# EAGLE design Arching_Civet (EAGLE 9.6.2)
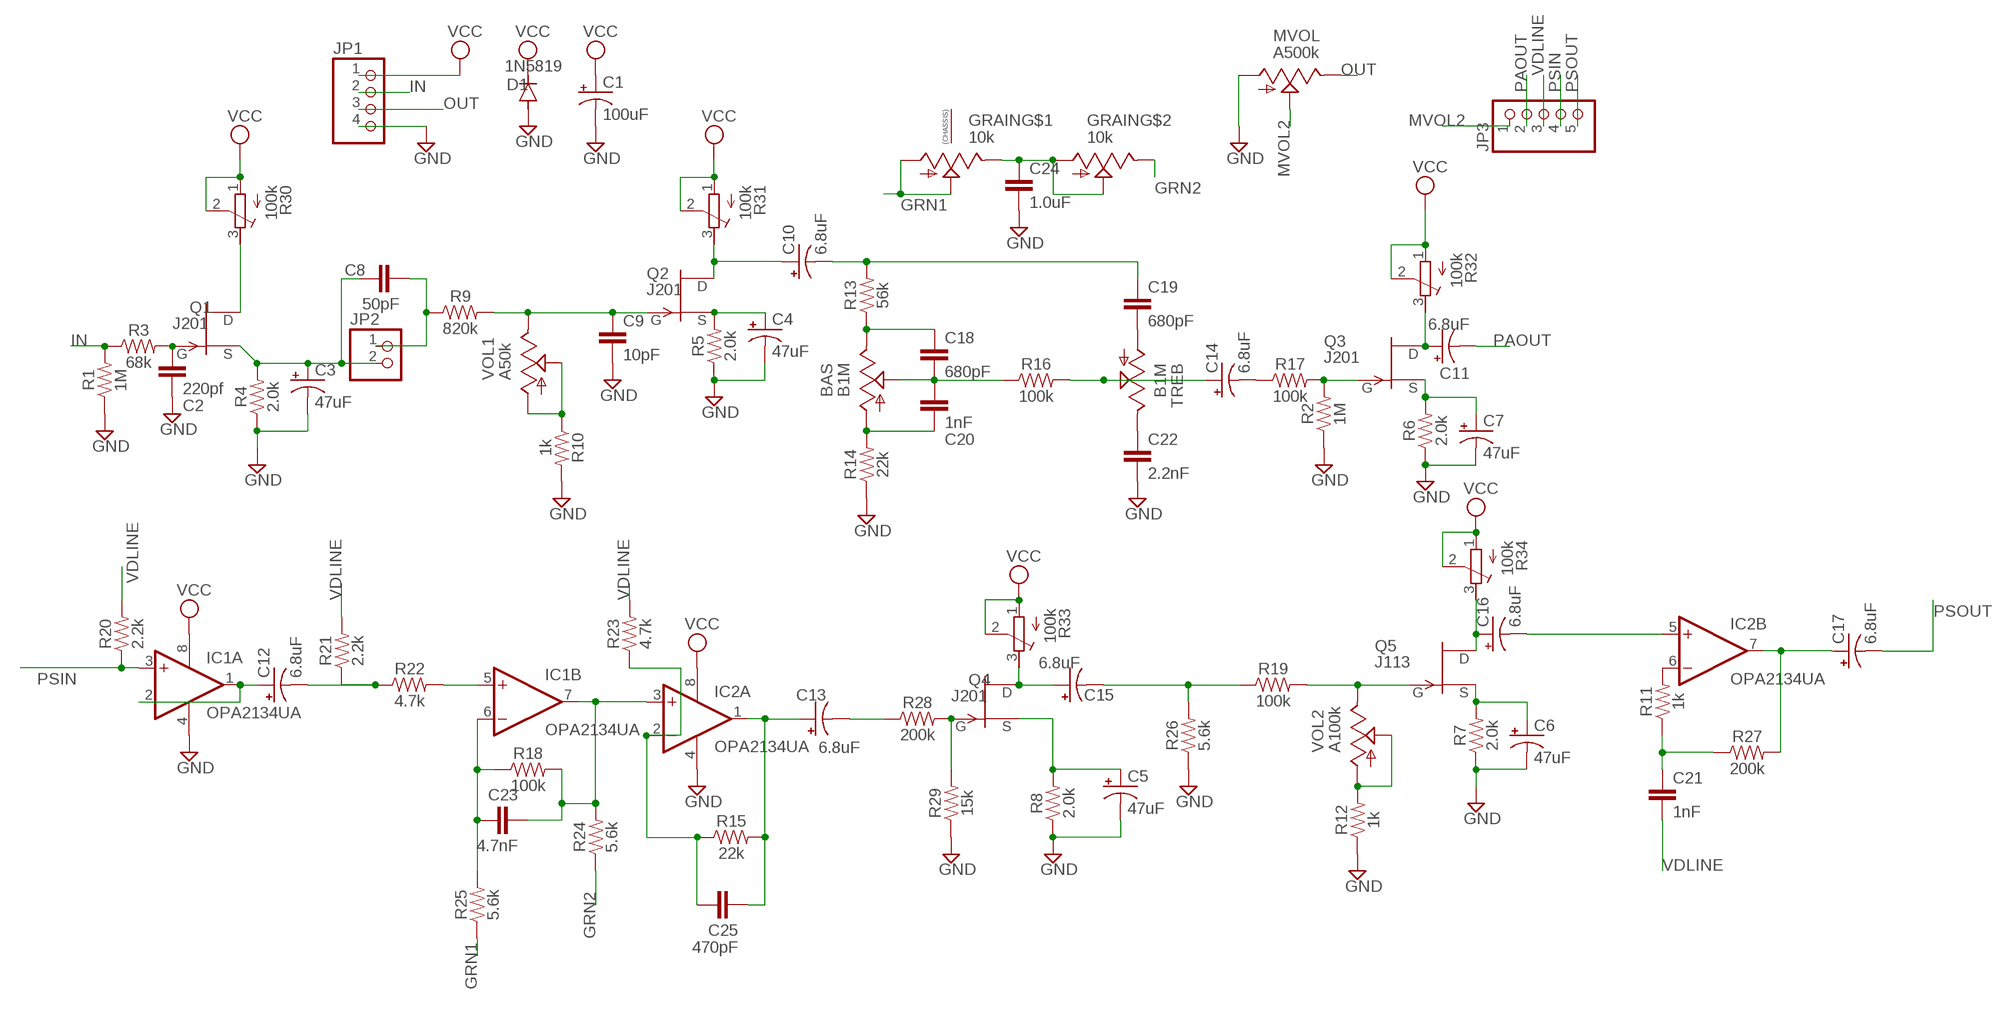
[diagram p0: schematic, sheet 1]

## Parts
BAS  B1M  9MM_SNAP-IN_POT_  [9MM_SNAP-IN_POT]
C1  100uF  CAP_SMD+THRUPAN_B  [PAN_B_SMD+THRU]
C2  220pf  270PF-0603-50V-5%  [0603]
C3  47uF  CAP_SMD+THRUPAN_B  [PAN_B_SMD+THRU]
C4  47uF  CAP_SMD+THRUPAN_B  [PAN_B_SMD+THRU]
C5  47uF  CAP_SMD+THRUPAN_B  [PAN_B_SMD+THRU]
C6  47uF  CAP_SMD+THRUPAN_B  [PAN_B_SMD+THRU]
C7  47uF  CAP_SMD+THRUPAN_B  [PAN_B_SMD+THRU]
C8  50pF  33PF-0603-50V-5%  [0603]
C9  10pF  10PF-0603-50V-5%  [0603]
C10  6.8uF  CAP_SMD+THRUPAN_B  [PAN_B_SMD+THRU]
C11  6.8uF  CAP_SMD+THRUPAN_B  [PAN_B_SMD+THRU]
C12  6.8uF  CAP_SMD+THRUPAN_B  [PAN_B_SMD+THRU]
C13  6.8uF  CAP_SMD+THRUPAN_B  [PAN_B_SMD+THRU]
C14  6.8uF  CAP_SMD+THRUPAN_B  [PAN_B_SMD+THRU]
C15  6.8uF  CAP_SMD+THRUPAN_B  [PAN_B_SMD+THRU]
C16  6.8uF  CAP_SMD+THRUPAN_B  [PAN_B_SMD+THRU]
C17  6.8uF  CAP_SMD+THRUPAN_B  [PAN_B_SMD+THRU]
C18  680pF  680PF-0603-50V-10%  [0603]
C19  680pF  680PF-0603-50V-10%  [0603]
C20  1nF  1.0NF/1000PF-0603-50V-10%  [0603]
C21  1nF  1.0NF/1000PF-0603-50V-10%  [0603]
C22  2.2nF  2.2NF/2200PF-0603-50V-10%  [0603]
C23  4.7nF  3.3NF-0603-100V-10%  [0603]
C24  1.0uF  1.0UF-0603-16V-10%  [0603]
C25  470pF  470PF-0603-50V-5%  [0603]
D1  1N5819  DIODE-SOD123  [SOD123]
GRAIN  10k  ALPHA-9MM-DUALPOT  [DUAL_9MM_SNAP-IN_POT]
IC1  OPA2134UA  [SO08]
IC2  OPA2134UA  [SO08]
JP1  PINHD-1X4  [1X04]
JP2  PINHD-1X2  [1X02]
JP3  PINHD-1X5  [1X05]
MVOL  A500k  9MM_SNAP-IN_POT_  [9MM_SNAP-IN_POT]
Q1  J201  SST201  [SOT23]
Q2  J201  SST201  [SOT23]
Q3  J201  SST201  [SOT23]
Q4  J201  SST201  [SOT23]
Q5  J113  SST201  [SOT23]
R1  1M  1MOHM-0603-1/4W-5%  [0603]
R2  1M  1MOHM-0603-1/4W-5%  [0603]
R3  68k  68.1KOHM-0603-1/10W-1%  [0603]
R4  2.0k  2.0KOHM-0603-1/10W-5%  [0603]
R5  2.0k  2.0KOHM-0603-1/10W-5%  [0603]
R6  2.0k  2.0KOHM-0603-1/10W-5%  [0603]
R7  2.0k  2.0KOHM-0603-1/10W-5%  [0603]
R8  2.0k  2.0KOHM-0603-1/10W-5%  [0603]
R9  820k  820KOHM-0603-1/10W-1%  [0603]
R10  1k  1KOHM-0603-1/10W-1%  [0603]
R11  1k  1KOHM-0603-1/10W-1%  [0603]
R12  1k  1KOHM-0603-1/10W-1%  [0603]
R13  56k  RESISTOR0603  [0603]
R14  22k  22KOHM-0603-1/10W-1%  [0603]
R15  22k  22KOHM-0603-1/10W-1%  [0603]
R16  100k  100KOHM-0603-1/10W-1%  [0603]
R17  100k  100KOHM-0603-1/10W-1%  [0603]
R18  100k  100KOHM-0603-1/10W-1%  [0603]
R19  100k  100KOHM-0603-1/10W-1%  [0603]
R20  2.2k  2.2KOHM-0603-1/10W-1%  [0603]
R21  2.2k  2.2KOHM-0603-1/10W-1%  [0603]
R22  4.7k  4.7KOHM-0603-1/10W-1%  [0603]
R23  4.7k  4.7KOHM-0603-1/10W-1%  [0603]
R24  5.6k  5.6KOHM-0603-1/10W-1%  [0603]
R25  5.6k  5.6KOHM-0603-1/10W-1%  [0603]
R26  5.6k  5.6KOHM-0603-1/10W-1%  [0603]
R27  200k  200KOHM-0603-1/10W-1%  [0603]
R28  200k  200KOHM-0603-1/10W-1%  [0603]
R29  15k  15KOHM-0603-1/10W-1%  [0603]
R30  100k  R-TRIMM3296W  [RTRIM3296W]
R31  100k  R-TRIMM3296W  [RTRIM3296W]
R32  100k  R-TRIMM3296W  [RTRIM3296W]
R33  100k  R-TRIMM3296W  [RTRIM3296W]
R34  100k  R-TRIMM3296W  [RTRIM3296W]
TREB  B1M  9MM_SNAP-IN_POT_  [9MM_SNAP-IN_POT]
VOL1  A50k  9MM_SNAP-IN_POT_  [9MM_SNAP-IN_POT]
VOL2  A100k  9MM_SNAP-IN_POT_  [9MM_SNAP-IN_POT]

## Nets
GND: C1.- C1.--(-) C2.2 C3.- C3.--(-) C4.- C4.--(-) C5.- C5.--(-) C6.- C6.--(-) C7.- C7.--(-) C9.2 C22.2 C24.2 D1.A IC1.4(A:V-) IC2.4(A:V-) JP1.4 MVOL.1(A) R1.1 R2.1 R4.1 R5.1 R6.1 R7.1 R8.1 R10.2 R12.1 R14.1 R26.1 R29.1
GRN1: GRAIN.1(A) GRAIN.2(S) R25.1
GRN2: GRAIN.3B(E) R24.1
IN: JP1.2 R1.2 R3.1
MVOL2: JP3.1 MVOL.2(S)
N$1: C2.1 Q1.3(G) R3.2
N$2: Q1.1(D) R30.3(E)
N$3: C3.+ C3.++(+) C8.1 JP2.2 Q1.2(S) R4.2
N$4: C8.2 JP2.1 R9.1
N$5: R10.1 VOL1.1(A) VOL1.2(S)
N$6: C9.1 Q2.3(G) R9.2 VOL1.3(E)
N$7: C10.+ C10.++(+) Q2.1(D) R31.3(E)
N$8: C4.+ C4.++(+) Q2.2(S) R5.2
N$9: C10.- C10.--(-) C19.1 R13.2
N$10: BAS.3(E) C18.1 R13.1
N$11: BAS.1(A) C20.2 R14.2
N$12: BAS.2(S) C18.2 C20.1 R16.1
N$13: C22.1 TREB.3(E)
N$14: C19.2 TREB.1(A)
N$15: C14.+ C14.++(+) R16.2 TREB.2(S)
N$16: C14.- C14.--(-) R17.1
N$17: Q3.3(G) R2.2 R17.2
N$18: C7.+ C7.++(+) Q3.2(S) R6.2
N$19: C11.+ C11.++(+) Q3.1(D) R32.3(E)
N$21: C12.+ C12.++(+) IC1.1(A:OUT) IC1.2(A:-IN)
N$22: C12.- C12.--(-) R21.1 R22.1
N$23: IC1.5(B:+IN) R22.2
N$24: C23.1 IC1.6(B:-IN) R18.1 R25.2
N$25: C23.2 IC1.7(B:OUT) IC2.3(A:+IN) R18.2 R24.2
N$26: C24.1 GRAIN.1B(A) GRAIN.2B(S) GRAIN.3(E)
N$27: C25.1 IC2.2(A:-IN) R15.1 R23.1
N$28: C13.+ C13.++(+) C25.2 IC2.1(A:OUT) R15.2
N$29: C13.- C13.--(-) R28.1
N$30: Q4.3(G) R28.2 R29.2
N$31: C5.+ C5.++(+) Q4.2(S) R8.2
N$32: C15.+ C15.++(+) Q4.1(D) R33.3(E)
N$33: Q5.3(G) R19.2 VOL2.3(E)
N$34: C15.- C15.--(-) R19.1 R26.2
N$35: C6.+ C6.++(+) Q5.2(S) R7.2
N$36: C16.- C16.--(-) IC2.5(B:+IN)
N$37: C16.+ C16.++(+) Q5.1(D) R34.3(E)
N$38: IC2.6(B:-IN) R11.2
N$39: C21.1 R11.1 R27.1
N$40: C17.+ C17.++(+) IC2.7(B:OUT) R27.2
N$41: R12.2 VOL2.1(A) VOL2.2(S)
OUT: JP1.3 MVOL.3(E)
PAOUT: C11.- C11.--(-) JP3.2
PSIN: IC1.3(A:+IN) JP3.4 R20.1
PSOUT: C17.- C17.--(-) JP3.5
VCC: C1.+ C1.++(+) D1.C IC1.8(A:V+) IC2.8(A:V+) JP1.1 R30.1(A) R30.2(S) R31.1(A) R31.2(S) R32.1(A) R32.2(S) R33.1(A) R33.2(S) R34.1(A) R34.2(S)
VDLINE: C21.2 JP3.3 R20.2 R21.2 R23.2
Unconnected: GRAIN.CHASSIS1 GRAIN.CHASSIS2

## Library data of the parts
BAS MVOL TREB VOL1 VOL2 = MusicThingModular:9MM_SNAP-IN_POT: 9mm vertical snap-in pot, Alpha / Panasonic style
C1 C3-C7 C10-C17 = MusicThingModular:CAP_SMD+THRU
C2 = SparkFun-Capacitors:270PF: 270pF/0.27nF ceramic capacitors A capacitor is a passive two-terminal electrical component used to store electrical energy temporarily in an electric field.; PROD_ID: CAP-13339; VALUE: 270PF
C8 = SparkFun-Capacitors:33PF: 33pF ceramic capacitors A capacitor is a passive two-terminal electrical component used to store electrical energy temporarily in an electric field.; PROD_ID: CAP-10142; VALUE: 33pF
C9 = SparkFun-Capacitors:10PF: 10pF ceramic capacitors A capacitor is a passive two-terminal electrical component used to store electrical energy temporarily in an electric field.; PROD_ID: CAP-11812
C18 C19 = SparkFun-Capacitors:680PF: 680pF/0.68nF ceramic capacitors A capacitor is a passive two-terminal electrical component used to store electrical energy temporarily in an electric field.; PROD_ID: CAP-09232
C20 C21 = SparkFun-Capacitors:1.0NF/1000PF: 1nF/1,000pF ceramic capacitors A capacitor is a passive two-terminal electrical component used to store electrical energy temporarily in an electric field.; PROD_ID: CAP-07886
C22 = SparkFun-Capacitors:2.2NF/2200PF: 2.2nF/2,200pF ceramic capacitors A capacitor is a passive two-terminal electrical component used to store electrical energy temporarily in an electric field.; PROD_ID: CAP-07877
C23 = SparkFun-Capacitors:3.3NF: 3.3nF ceramic capacitors A capacitor is a passive two-terminal electrical component used to store electrical energy temporarily in an electric field.; PROD_ID: CAP-09633; VALUE: 3.3nF
C24 = SparkFun-Capacitors:1.0UF: 1µF ceramic capacitors A capacitor is a passive two-terminal electrical component used to store electrical energy temporarily in an electric field.; PROD_ID: CAP-00868
C25 = SparkFun-Capacitors:470PF: 470pF ceramic capacitors A capacitor is a passive two-terminal electrical component used to store electrical energy temporarily in an electric field.; PROD_ID: CAP-07884
D1 = diode:DIODE-: DIODE
GRAIN = MusicThingModular:ALPHA-9MM-DUALPOT: 9mm vertical snap-in pot, Alpha / Panasonic style, with a connection to the metal chassis for grounding
IC1 IC2 = linear:OPA2*: Dual Operational Amplifier Low Power, Single-Supply, Rail-To-Rail Operational Amplifier Source: http://focus.ti.com/lit/ds/symlink/opa2345.pdf http://focus.ti.com .. opa241.pdf http://focus.ti.com/lit/ds/symlink/opa2134.pdf
JP1 = Connector:PINHD-1X4: PIN HEADER; CATEGORY: CONNECTOR; SUB-CATEGORY: PIN-HEADER
JP2 = pinhead:PINHD-1X2: PIN HEADER
JP3 = pinhead:PINHD-1X5: PIN HEADER
Q1-Q5 = transistor-fet:?20*: TEMIC / Siliconix N-Channel JFET Source: JFET-J201_Siliconix_data.pdf
R1 R2 = SparkFun-Resistors:1MOHM: 1MΩ resistor A resistor is a passive two-terminal electrical component that implements electrical resistance as a circuit element. Resistors act to reduce current flow, and, at the same time, act to lower voltage levels within circuits. - Wikipedia; PROD_ID: RES-07868
R3 = SparkFun-Resistors:68.1KOHM: 68.1kΩ resistor A resistor is a passive two-terminal electrical component that implements electrical resistance as a circuit element. Resistors act to reduce current flow, and, at the same time, act to lower voltage levels within circuits. - Wikipedia; PROD_ID: RES-09380; VALUE: 68.1k
R4-R8 = SparkFun-Resistors:2.0KOHM: 2kΩ resistor A resistor is a passive two-terminal electrical component that implements electrical resistance as a circuit element. Resistors act to reduce current flow, and, at the same time, act to lower voltage levels within circuits. - Wikipedia; PROD_ID: RES-08296
R9 = SparkFun-Resistors:820KOHM: 820kΩ resistor A resistor is a passive two-terminal electrical component that implements electrical resistance as a circuit element. Resistors act to reduce current flow, and, at the same time, act to lower voltage levels within circuits. - Wikipedia; PROD_ID: RES-13247
R10-R12 = SparkFun-Resistors:1KOHM: 1kΩ resistor A resistor is a passive two-terminal electrical component that implements electrical resistance as a circuit element. Resistors act to reduce current flow, and, at the same time, act to lower voltage levels within circuits. - Wikipedia; PROD_ID: RES-07856
R13 = SparkFun-Resistors:RESISTOR: Generic Resistor Package
R14 R15 = SparkFun-Resistors:22KOHM: 22kΩ resistor A resistor is a passive two-terminal electrical component that implements electrical resistance as a circuit element. Resistors act to reduce current flow, and, at the same time, act to lower voltage levels within circuits. - Wikipedia; PROD_ID: RES-07853
R16-R19 = SparkFun-Resistors:100KOHM: 100kΩ resistor A resistor is a passive two-terminal electrical component that implements electrical resistance as a circuit element. Resistors act to reduce current flow, and, at the same time, act to lower voltage levels within circuits. - Wikipedia; PROD_ID: RES-07828
R20 R21 = SparkFun-Resistors:2.2KOHM: 2.2kΩ resistor A resistor is a passive two-terminal electrical component that implements electrical resistance as a circuit element. Resistors act to reduce current flow, and, at the same time, act to lower voltage levels within circuits. - Wikipedia; PROD_ID: RES-08272
R22 R23 = SparkFun-Resistors:4.7KOHM: 4.7kΩ resistor A resistor is a passive two-terminal electrical component that implements electrical resistance as a circuit element. Resistors act to reduce current flow, and, at the same time, act to lower voltage levels within circuits. - Wikipedia; PROD_ID: RES-07857
R24-R26 = SparkFun-Resistors:5.6KOHM: 5.6kΩ resistor A resistor is a passive two-terminal electrical component that implements electrical resistance as a circuit element. Resistors act to reduce current flow, and, at the same time, act to lower voltage levels within circuits. - Wikipedia; PROD_ID: RES-12378
R27 R28 = SparkFun-Resistors:200KOHM: 200kΩ resistor A resistor is a passive two-terminal electrical component that implements electrical resistance as a circuit element. Resistors act to reduce current flow, and, at the same time, act to lower voltage levels within circuits. - Wikipedia; PROD_ID: RES-09385
R29 = SparkFun-Resistors:15KOHM: 15kΩ resistor A resistor is a passive two-terminal electrical component that implements electrical resistance as a circuit element. Resistors act to reduce current flow, and, at the same time, act to lower voltage levels within circuits. - Wikipedia; PROD_ID: RES-07854
R30-R34 = resistor:R-TRIMM: Trimm resistor

## Board
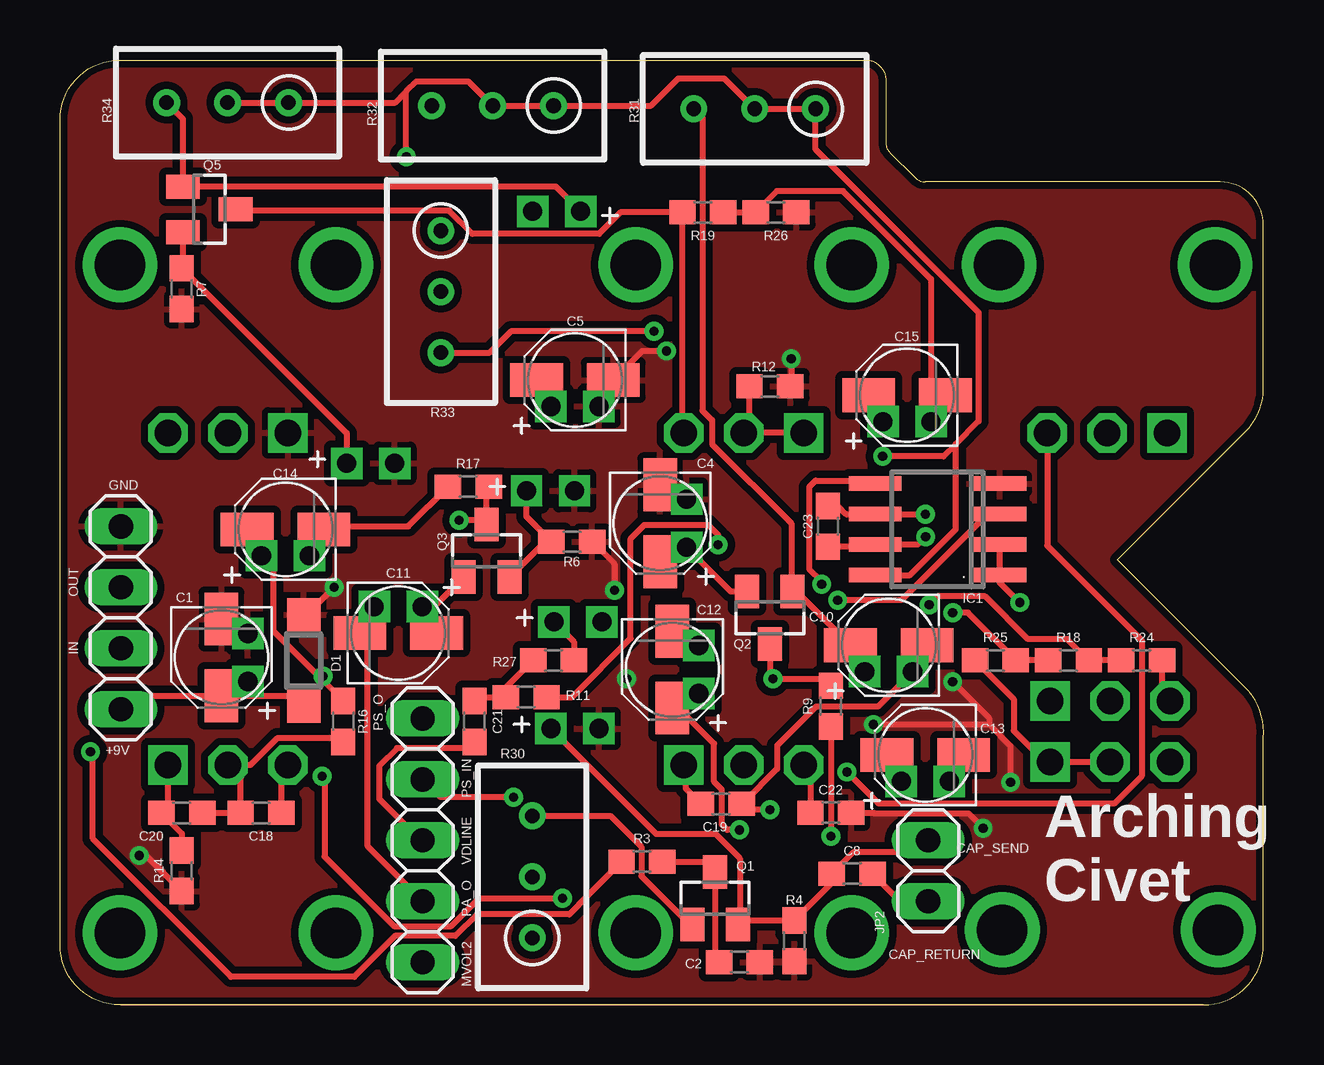
[diagram p1: board, top side]
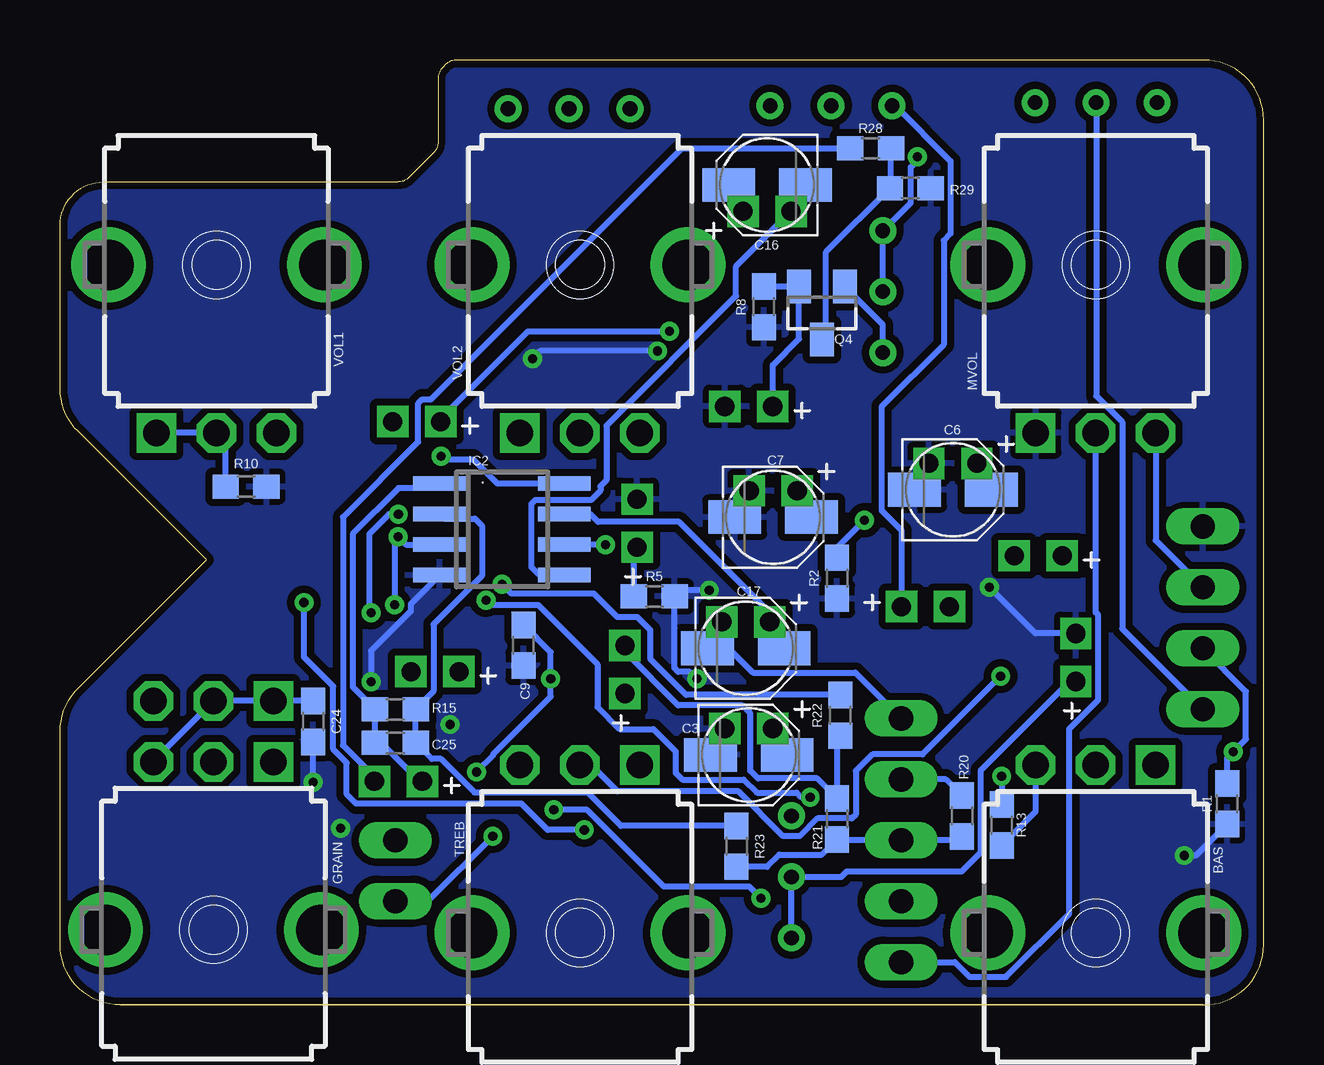
[diagram p2: board, bottom side, seen from below]

Size 50.17 x 39.37 mm. Coordinates in mm from the lower left corner, seen from the top.
Outline: 2.54,0 47.62,0
Outline: 47.66,0 2.5,0 arc-90 0,2.5 0,36.87 arc-90 2.5,39.37 33.65,39.37 arc-45 34.09,39.18 34.23,39.05 arc-45 34.42,38.6 34.42,35.95 arc45 34.6,35.5 35.63,34.48 arc45 36.08,34.29 48.36,34.29 arc-90 50.16,32.48 50.16,25.69 arc-45 49.42,23.89 44.07,18.54 49.55,13.06 arc-45 50.16,11.14 50.16,2.5 arc-90 47.66,0
Copper layers (1*16): Top 0.035mm / dielectric 1.5mm / Bottom 0.035mm
Design rules "default *": minimum track width 6mil, minimum drill 0.35mm, track to track 6mil, track to pad 6mil, pad to pad 6mil, via to via 6mil, smd to smd 6mil, copper to edge 10mil, drill to drill 6mil, minimum pad ring 10mil, minimum via ring 8mil, stop-mask expansion 4mil, vias tented up to drill 0mil, thermal gap 10mil

### Footprints (pad centres in the part's own frame; a part is rotated, then mirrored left to right if it is on the bottom)
9MM_SNAP-IN_POT = drill 1.1 square: 1 -2.5,-7 | drill 1.1 octagon: 2 0,-7; 3 2.5,-7 | drill 2.1 pad 2.794: CHASSIS1 -4.5,0; CHASSIS2 4.5,0
PAN_B_SMD+THRU = smd 2.2 x 1.4: + 1.6,0; - -1.6,0 | drill 0.8 pad 0.9 square: ++ 1,1.1; -- -1,1.1
0603 = smd 1.1 x 1: 1 -0.85,0; 2 0.85,0
SOD123 = smd 1.4 x 1.4: A 1.9,0; C -1.9,0
DUAL_9MM_SNAP-IN_POT = drill 1.1 square: 1 -2.5,-7; 1B -2.5,-9.54 | drill 1.1 octagon: 2 0,-7; 2B 0,-9.54; 3 2.5,-7; 3B 2.5,-9.54 | drill 2.1 pad 2.54: CHASSIS1 -4.5,0; CHASSIS2 4.5,0
SO08 = smd 0.6 x 2.2: 1 -1.905,-2.6; 2 -0.635,-2.6; 3 0.635,-2.6; 4 1.905,-2.6; 5 1.905,2.6; 6 0.635,2.6; 7 -0.635,2.6; 8 -1.905,2.6
1X04 = drill 1.016 long: 1 -3.81,0; 2 -1.27,0; 3 1.27,0; 4 3.81,0
1X02 = drill 1.016 long: 1 -1.27,0; 2 1.27,0
1X05 = drill 1.016 long: 1 -5.08,0; 2 -2.54,0; 3 0,0; 4 2.54,0; 5 5.08,0
SOT23 = smd 1 x 1.4: 1 -0.95,-1.1; 2 0.95,-1.1; 3 0,1.1
RTRIM3296W = drill 0.61: 1 0,-2.54; 2 0,0; 3 0,2.54

### Placement (x,y rotation side)
BAS  7,3 180 bottom
C1  6.73,14.48 270 top
C2  28.32,1.78 0 top
C3  21.46,10.41 0 bottom
C4  25.02,20.07 270 top
C5  21.46,26.04 180 top
C6  12.95,21.46 0 bottom
C7  20.45,20.32 0 bottom
C8  33.02,5.46 0 top
C9  30.86,14.99 270 bottom
C10  34.54,14.99 180 top
C11  14.1,15.49 0 top
C12  25.53,13.97 270 top
C13  36.07,10.41 180 top
C14  9.4,19.81 180 top
C15  35.31,25.4 180 top
C16  20.7,34.16 180 bottom
C17  21.59,14.86 0 bottom
C18  8.38,8 180 top
C19  27.56,8.38 180 top
C20  5.08,8 180 top
C21  17.27,11.81 270 top
C22  32.13,8 0 top
C23  32,19.94 270 top
C24  39.62,11.81 270 bottom
C25  36.2,10.92 180 bottom
D1  10.16,14.35 90 top
GRAIN  43.78,3.13 180 bottom
IC1  36.58,19.81 90 top
IC2  31.75,19.81 270 bottom
JP1  2.54,16.13 90 top
JP2  36.2,5.59 90 top
JP3  15.11,6.86 90 top
MVOL  7,30.83 0 bottom
Q1  27.3,4.45 0 top
Q2  29.59,16.13 180 top
Q3  17.78,18.92 0 top
Q4  18.41,28.83 180 bottom
Q5  6.22,33.15 270 top
R1  1.52,8.38 90 bottom
R2  17.78,17.78 90 bottom
R3  24.26,5.97 0 top
R4  30.61,2.67 90 top
R5  25.4,17.02 180 bottom
R6  21.34,19.3 180 top
R7  5.08,29.84 90 top
R8  20.83,29.08 90 bottom
R9  32.13,12.45 90 top
R10  42.42,21.59 0 bottom
R11  19.43,12.83 0 top
R12  29.59,25.78 180 top
R13  10.92,7.49 90 bottom
R14  5.08,5.59 90 top
R15  36.2,12.32 180 bottom
R16  11.81,11.81 90 top
R17  17.02,21.59 0 top
R18  42.04,14.35 0 top
R19  26.8,33.02 180 top
R20  12.57,7.87 270 bottom
R21  17.78,7.75 270 bottom
R22  17.65,12.06 90 bottom
R23  21.97,6.6 270 bottom
R24  45.09,14.35 180 top
R25  38.99,14.35 0 top
R26  29.84,33.02 180 top
R27  20.57,14.35 0 top
R28  16.38,35.69 0 bottom
R29  14.73,34.04 180 bottom
R30  19.68,5.33 0 top
R31  28.96,37.34 90 top
R32  18.03,37.47 90 top
R33  15.88,29.72 180 top
R34  6.99,37.59 90 top
TREB  28.5,3 180 bottom
VOL1  43.65,30.83 0 bottom
VOL2  28.5,30.83 0 bottom

### Tracks (layer width: path | path; a pad name or v marks a point on that pad's centre or on a via)
GND  (via drill 0.38)
  Top 0.254: v3.3,6.22 3.6,6.22 R14.1 | C22.2 33.93,8 33.96,7.97 37.87,7.97 v38.48,7.37 | v33.91,11.68 38.73,11.68 | 38.73,11.68 39.62,10.79 v39.62,9.27 | v37.21,13.46 38.73,11.93 38.73,11.68 | R6.1 23.11,18.38 v23.11,17.27 | C5.- 24.27,27.25 v25.27,27.25 | v30.48,26.92 30.48,25.82 R12.1 | v11.43,17.4 10.28,16.25 D1.A
  Bottom 0.254: R1.1 2.83,6.22 v3.3,6.22 | C3.- 22.46,11.01 C3.-- | v39.62,9.27 C24.2 | IC2.4 35.56,16.7 35.56,16.39 37.21,14.74 v37.21,13.46 | v23.11,17.27 24.3,17.27 R5.1 24.55,15.69 24.57,15.68 24.57,14.04 24.41,13.88 23.91,13.88 v23.62,13.59 | v25.27,27.25 30.16,27.25 v30.48,26.92 | C1.-- 9.51,15.48 v11.43,17.4
  pour Bottom (isolate 0.305): 0,40.64 -1.27,39.37 -1.27,-1.27 52.07,-1.27 52.07,40.64
  pour Top (isolate 0.305): 0,40.64 -1.27,39.37 -1.27,-1.27 52.07,-1.27 52.07,40.64
GRN1
  Top 0.254: R25.1 39.75,12.74 39.75,11.43 41.05,10.13 GRAIN.1 GRAIN.2
GRN2
  Top 0.254: GRAIN.3B 46.38,12.77 45.94,13.21 R24.1
IN  (via drill 0.38)
  Top 0.254: v1.27,10.54 1.37,10.44 1.37,6.93 7.13,1.16 12.26,1.16 13.97,2.87 16.48,2.87 17.38,3.77 21.23,3.77 21.63,4.17 21.63,4.19 R3.1
  Bottom 0.254: R1.2 1.52,10.29 v1.27,10.54 0.74,11.07 0.74,13.06 JP1.2
MVOL2
  Bottom 0.254: MVOL.2 7,16.35 6.9,16.25 6.9,12.71 8.1,11.5 8.1,3.8 10.74,1.16 12.26,1.16 12.88,1.78 JP3.1
N$1
  Top 0.254: R3.2 26.88,5.97 Q1.3 27.3,1.94 C2.1
N$2
  Top 0.254: R30.3 22.95,7.87 24.24,6.58 24.24,5.36 26.25,3.35 Q1.1
N$3
  Top 0.254: JP2.2 35.69,6.35 33.06,6.35 C8.1 32.17,5.08 R4.2 28.43,3.52 Q1.2 28.34,3.43 28.34,6.11 27.32,7.13 24.85,7.13 C3.++
  Bottom 0.254: C3.+ 19.86,10.91 C3.++
N$4  (via drill 0.38)
  Top 0.254: C8.2 35.01,4.32 JP2.1 | R9.1 v32.13,7.03
  Bottom 0.254: v32.13,7.03 34.84,4.32 JP2.1
N$5
  Bottom 0.254: R10.1 43.27,23.45 VOL1.2 VOL1.1
N$6  (via drill 0.38)
  Top 0.254: Q2.3 29.59,13.72 v29.72,13.59 31.84,13.59 R9.2 | VOL1.3 41.15,19.13 45.09,15.2 45.09,9.53 43.94,8.38 34.13,8.38 v32.8,9.71
  Bottom 0.254: C9.1 29.72,14.69 v29.72,13.59 29.72,12.84 32.1,10.46 32.1,10.4 v32.8,9.71
N$7
  Top 0.254: C10.++ 33.54,14.39 C10.+ 30.7,17.23 Q2.1 30.48,17.29 30.48,20.06 27.18,23.36 27.18,24.36 26.78,24.77 26.78,36.98 R31.3
N$8
  Top 0.254: C4.+ 25.62,19.07 C4.++ 27.96,17.23 Q2.2
  Bottom 0.254: R5.2 26.25,18.93 C4.++
N$9  (via drill 0.38)
  Top 0.254: C10.- 35.54,14.39 C10.-- 34.08,12.43 31.52,12.43 29.9,10.81 29.9,9.83 28.51,8.45 | 28.51,8.45 28.44,8.38 C19.1 | v10.92,9.53 11.02,9.42 11.02,6.17 13.92,3.28 16.31,3.28 17.48,4.45 v20.95,4.45 | v29.59,8.13 28.83,8.13 28.51,8.45
  Bottom 0.254: v10.92,9.53 R13.2 | v20.95,4.45 21.43,4.92 25,4.92 28.2,8.13 v29.59,8.13
N$10
  Top 0.254: C18.1 9.23,9.73 BAS.3
  Bottom 0.254: R13.1 9.5,8.06 BAS.3
N$11
  Top 0.254: BAS.1 4.5,8.27 C20.2 5.08,7.15 R14.2
N$12
  Top 0.254: C20.1 C18.2 7.53,9.47 BAS.2 7.94,10 9.04,11.1 11.67,11.1 R16.1
N$13
  Top 0.254: TREB.3 31.28,9.72 C22.1
N$14
  Top 0.254: TREB.1 26.07,9.93 26.07,9.02 C19.2
N$15  (via drill 0.38)
  Top 0.254: C14.+ 7.8,19.31 C14.++ 8.89,18.22 8.89,15.58 10.97,13.51 | R16.2 10.97,13.51 | 10.97,13.51 v10.97,13.7
  Bottom 0.254: v10.97,13.7 14.22,10.44 16.31,10.44 17,9.74 17,7.93 17.16,7.77 18.61,7.77 19.34,7.04 20.03,7.04 21.89,8.9 26.94,8.9 28.05,10 TREB.2
N$16
  Top 0.254: R17.1 14.52,19.94 11.12,19.94 C14.- 10.4,19.21 C14.--
N$17  (via drill 0.38)
  Top 0.254: R17.2 17.78,21.5 Q3.3 17.61,20.19 v16.64,20.19
  Bottom 0.254: v16.64,20.19 17.78,19.05 R2.2
N$18
  Top 0.254: Q3.2 20.21,19.3 R6.2 19.45,20.34 C7.++
  Bottom 0.254: C7.++ 19.45,20.92 C7.+
N$19
  Top 0.254: C11.+ 15.7,15.99 C11.++ 15.6,16.59 Q3.1
  Bottom 0.254: R32.3 15.36,37.47 13.05,35.16 13.05,32.13 13.34,31.85 13.34,27.51 15.93,24.92 15.93,20.61 15.1,19.77 C11.++
N$21  (via drill 0.38)
  Top 0.254: C12.++ 26.13,12.97 C12.+ 25.78,12.37 27.27,10.88 27.27,9.29 27.58,8.98 27.58,7.52 27.81,7.29 v28.32,7.29 | IC1.2 IC1.1 39.18,17.59 v40.01,16.76
  Bottom 0.254: v40.01,16.76 40.01,14.49 38.79,13.27 38.79,10.64 38.22,10.08 38.22,8.77 37.84,8.38 30.94,8.38 29.84,7.29 v28.32,7.29
N$22
  Top 0.254: C12.- 26.03,15.57 C12.--
  Bottom 0.254: R22.1 17.78,11.09 R21.1 18.62,9.44 21.08,9.44 21.4,9.75 21.4,12.15 21.73,12.48 24.41,12.48 26.63,14.7 C12.--
N$23  (via drill 0.38)
  Top 0.254: v31.75,17.53 31.75,17.65 31.23,18.18 31.23,21.57 31.5,21.84 32.96,21.84 33.09,21.72 IC1.5
  Bottom 0.254: v31.75,17.53 31.37,17.14 27.93,17.14 26.94,16.16 26.11,16.16 25.57,15.61 25.57,14.4 24.08,12.91 R22.2
N$24  (via drill 0.38)
  Top 0.254: C23.1 32.42,20.79 32.77,20.45 IC1.6 v36.07,20.45 | R18.1 R25.2 37.84,16.34 v37.21,16.34
  Bottom 0.254: v36.07,20.45 36.46,20.45 37.29,19.62 37.29,16.42 v37.21,16.34
N$25  (via drill 0.38)
  Top 0.254: v36.23,16.67 36.58,17.02 38.57,17.02 40.35,15.24 42,15.24 R18.2 R24.2 | v36.08,19.51 35.75,19.18 IC1.7 33.89,19.09 C23.2
  Bottom 0.254: v36.23,16.67 36.23,19.36 v36.08,19.51 35.75,19.18 IC2.3
N$26
  Bottom 0.254: GRAIN.3 46.28,10.17 GRAIN.2B GRAIN.1B C24.1
N$27
  Bottom 0.254: IC2.2 34.17,20.26 32.88,20.26 32.59,19.97 32.59,17.87 34.6,15.86 34.6,13.06 R15.1 C25.1 34.67,10.25 34.3,10.25 32.9,8.85 28.19,8.85 26.8,7.45 R23.1
N$28
  Top 0.254: C13.++ 35.07,9.81 C13.+
  Bottom 0.254: C13.++ 35.18,9.31 36.79,10.92 C25.2 R15.2 37.97,13.25 37.97,19.62 36.06,21.53 34.53,21.53 IC2.1
N$29
  Top 0.254: C13.-- 37.07,9.81 C13.-
  Bottom 0.254: C13.-- 37.07,9.5 38.38,10.81 38.38,20.32 35.24,23.46 35.24,25.07 35.08,25.23 34.71,25.23 24.26,35.69 R28.1
N$30
  Bottom 0.254: R28.2 15.53,34.09 R29.2 18.24,31.37 18.24,27.9 Q4.3
N$31
  Top 0.254: C5.++ 19.86,25.54 C5.+
  Bottom 0.254: C5.++ 20.46,26.65 19.36,27.75 Q4.2 R8.2
N$32  (via drill 0.38)
  Top 0.254: C15.++ 33.71,24.9 C15.+ | v24.77,28.07 18.8,28.07 17.91,27.18 R33.3
  Bottom 0.254: R33.3 15.88,28.34 Q4.1 | v24.77,28.07 30.67,28.07 34.31,24.43 C15.++
N$33
  Top 0.254: VOL2.3 25.95,23.89 R19.2 23.36,33.02 22.47,32.13 17.19,32.13 16.22,33.1 7.37,33.1 Q5.3
N$34
  Top 0.254: R19.1 R26.2 29.88,33.91 32.64,33.91 36.31,30.24 C15.-- 36.31,24.8 C15.-
N$35
  Top 0.254: Q5.2 5.12,30.74 R7.2 11.95,23.82 C6.++
  Bottom 0.254: C6.+ 11.35,21.96 C6.++
N$36
  Bottom 0.254: C16.- 19.1,33.66 C16.-- 21.99,30.78 21.99,29.54 27.4,24.13 27.4,21.85 27.64,21.6 27.64,21.43 28.05,21.03 30.37,21.03 30.53,20.86 30.53,18.25 30.24,17.96 29.21,17.96 IC2.5
N$37
  Top 0.254: R34.3 5.12,36.91 Q5.1 20.67,34.1 C16.++
  Bottom 0.254: C16.++ 21.7,33.56 C16.+
N$38  (via drill 0.38)
  Top 0.254: v27.43,19.18 27.43,19.58 27.02,20 24.36,20 23.79,19.43 23.79,15.27 21.34,12.83 R11.2
  Bottom 0.254: v27.43,19.18 IC2.6
N$39
  Top 0.254: C21.1 17.44,12.83 R11.1 18.58,13.21 R27.1
N$40
  Top 0.254: C17.++ 21.42,15.12 R27.2
  Bottom 0.254: C17.+ 20.59,15.46 C17.++ 20.59,16.34 24.37,20.12 27.74,20.12 28.07,20.45 IC2.7
N$41
  Top 0.254: VOL2.1 VOL2.2 28.74,24.07 R12.2
OUT
  Bottom 0.254: MVOL.3 4.5,19.36 JP1.3
PAOUT
  Top 0.254: C11.-- 12.5,15.99 C11.- 12.83,15.16 12.83,6.6 JP3.2
PSIN  (via drill 0.38)
  Top 0.254: IC1.3 39.05,20.32 38.52,20.32 35.06,16.86 v32.41,16.86 | v18.9,8.65 15.86,8.65 JP3.4
  Bottom 0.254: R20.1 13.25,9.4 JP3.4 | v18.9,8.65 19.28,8.65 19.46,8.84 21.13,8.84 21.68,9.38 24.23,9.38 24.52,9.67 24.52,10.56 25.44,11.48 26.85,11.48 27.77,12.41 27.77,14.2 30.25,16.66 32.22,16.66 v32.41,16.86
PSOUT
  Bottom 0.254: C17.-- 22.59,14.94 22.67,14.86 C17.- 22.3,14.86 21.29,13.84 17.02,13.84 JP3.5
VCC  (via drill 0.38)
  Top 0.254: R34.2 R34.1 13.97,37.59 14.44,38.06 | C1.++ 7.23,12.88 C1.+ | C1.+ 9.73,12.88 D1.C | 14.44,38.06 14.86,38.48 17.02,38.48 R32.2 R32.1 24.64,37.47 25.78,38.61 27.69,38.61 R31.2 R31.1 31.5,35.65 38.28,28.86 38.28,24.32 37.34,23.36 | JP1.1 3.1,12.88 C1.+ | v14.44,35.34 14.44,38.06 | IC1.8 35.43,17.91 37.34,19.81 37.34,23.36 | 37.34,23.36 36.83,22.86 v34.29,22.86
  Bottom 0.254: R33.2 R33.1 14.71,33.42 14.71,34.91 14.44,35.18 v14.44,35.34 | R34.2 6.99,25.38 5.9,24.29 5.9,15.68 JP1.1 | C1.++ 8.09,13.48 11.79,9.77 11.79,6.36 12.59,5.56 17.37,5.56 17.6,5.33 R30.2 R30.1 | IC2.8 31.94,21.72 32.96,22.73 34.16,22.73 v34.29,22.86
VDLINE
  Top 0.254: C21.2 17,10.69 14.05,10.69 13.31,9.96 13.31,8.59 15.04,6.86 JP3.3
  Bottom 0.254: R20.2 12.53,6.99 12.66,6.86 JP3.3 17.74,6.86 R21.2 18.41,6.26 20.19,6.26 20.7,5.75 R23.2

### Text on the board
tPlace: GND | . | OUT | IN | PS_O | +9V | PS_IN | CAP_SEND | VDLINE | PA_O | Arching / Civet | CAP_RETURN | MVOL2
bPlace: .